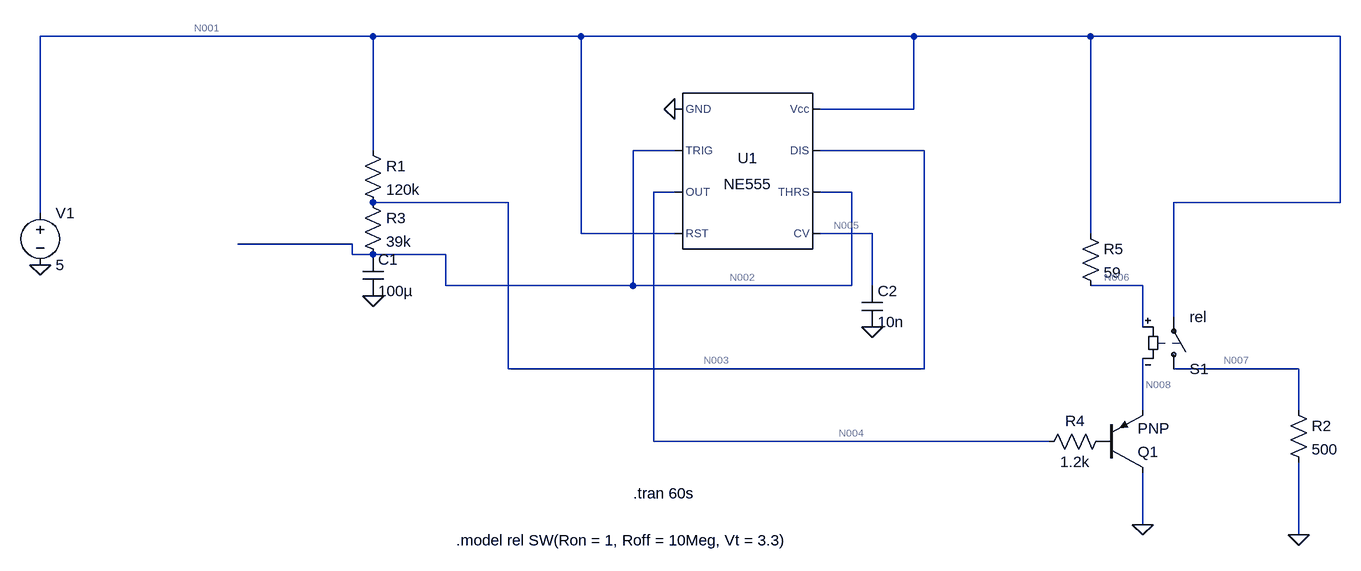
[diagram p0: schematic board_red_inv.asc]
board_red_inv.asc, the LTspice schematic file:
Version 4
SHEET 1 1948 856
WIRE 32 64 -480 64
WIRE 352 64 32 64
WIRE 864 64 352 64
WIRE 1136 64 864 64
WIRE 1520 64 1136 64
WIRE 864 176 864 64
WIRE 864 176 720 176
WIRE 32 240 32 64
WIRE 496 240 432 240
WIRE 880 240 720 240
WIRE 496 304 464 304
WIRE 768 304 720 304
WIRE 240 320 32 320
WIRE 1520 320 1520 64
WIRE 1520 320 1264 320
WIRE -480 336 -480 64
WIRE 352 368 352 64
WIRE 496 368 352 368
WIRE 800 368 720 368
WIRE 1136 368 1136 64
WIRE 0 384 -176 384
WIRE 0 400 0 384
WIRE 32 400 0 400
WIRE 144 400 32 400
WIRE 144 448 144 400
WIRE 432 448 432 240
WIRE 432 448 144 448
WIRE 768 448 768 304
WIRE 768 448 432 448
WIRE 800 448 800 368
WIRE 1216 448 1136 448
WIRE 1264 496 1264 320
WIRE 1216 512 1216 448
WIRE 240 576 240 320
WIRE 880 576 880 240
WIRE 880 576 240 576
WIRE 1456 576 1264 576
WIRE 1216 640 1216 560
WIRE 1456 640 1456 576
WIRE 464 688 464 304
WIRE 1072 688 464 688
WIRE 1216 816 1216 736
WIRE 1456 832 1456 720
FLAG 800 512 0
FLAG -480 416 0
FLAG 496 176 0
FLAG 32 464 0
FLAG 1216 816 0
FLAG 1456 832 0
SYMBOL Misc/NE555 608 272 R0
SYMATTR InstName U1
SYMBOL Res 16 224 R0
SYMATTR InstName R1
SYMATTR Value 120k
SYMBOL Res 16 304 R0
SYMATTR InstName R3
SYMATTR Value 39k
SYMBOL Cap 16 400 R0
SYMATTR InstName C1
SYMATTR Value 100µ
SYMBOL Voltage -480 320 R0
SYMATTR InstName V1
SYMATTR Value 5
SYMBOL Cap 784 448 R0
SYMATTR InstName C2
SYMATTR Value 10n
SYMBOL Res 1168 672 R90
WINDOW 0 0 56 VBottom 2
WINDOW 3 32 56 VTop 2
SYMATTR InstName R4
SYMATTR Value 1.2k
SYMBOL pnp 1152 736 M180
SYMATTR InstName Q1
SYMBOL sw 1264 592 M180
SYMATTR InstName S1
SYMATTR Value rel
SYMBOL Res 1440 624 R0
SYMATTR InstName R2
SYMATTR Value 500
SYMBOL Res 1120 352 R0
SYMATTR InstName R5
SYMATTR Value 59
TEXT 432 768 Left 2 !.tran 60s
TEXT 160 840 Left 2 !.model rel SW(Ron = 1, Roff = 10Meg, Vt = 3.3)

The netlist it stands for:
* board_red_inv.asc
XU1 0 N002 N004 N001 N005 N002 N003 N001 NE555  ; pins GND TRIG OUT RST CV THRS DIS Vcc
R1 N001 N003 120k
R3 N003 N002 39k
C1 N002 0 100µ
V1 N001 0 5
C2 N005 0 10n
R4 P001 N004 1.2k
Q1 0 P001 N008 0 PNP
S1 N007 N001 N006 N008 rel
R2 N007 0 500
R5 N001 N006 59
.model NPN NPN
.model PNP PNP
.lib standard.bjt
.tran 60s
.model rel SW(Ron = 1, Roff = 10Meg, Vt = 3.3)
.lib NE555.sub
.backanno
.end

* Results of the author's LTspice run, read from the files saved beside the schematic
* Operating Point, zero values left out:
*   V(n002) = 4.998 V
*   V(n005) = 3.333 V
*   V(n001) = 5 V
*   V(n003) = 4.998 V
*   V(n004) = 5 V
*   V(p001) = 5 V
*   V(n008) = 5 V
*   V(n007) = 250 µV
*   V(n006) = 5 V
*   Ic(Q1) = -5 pA
*   Ib(Q1) = 5 pA
*   I(R1) = 16.66 nA
*   I(R3) = 9.995 nA
*   I(R4) = -5 pA
*   I(R2) = 500 nA
*   I(S1) = 500 nA
*   I(V1) = -1.612 mA
*   Ix(u1:1) = -1.611 mA
*   Ix(u1:2) = 4.998 nA
*   Ix(u1:3) = -5 pA
*   Ix(u1:4) = 22.67 µA
*   Ix(u1:6) = 4.998 nA
*   Ix(u1:7) = 6.669 nA
*   Ix(u1:8) = 1.588 mA
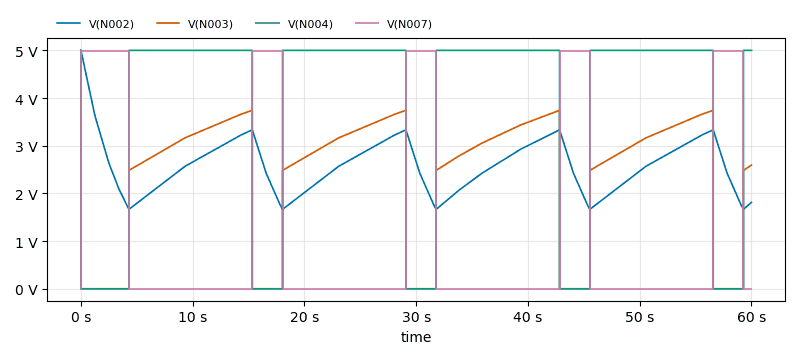
[diagram p1: Transient Analysis of board_red_inv.asc, plotted from the saved traces]
* Transient Analysis, 1 run:
*   V(N002): min 1.666 V, max 4.998 V, average 2.576 V, rms 2.651 V, last 1.813 V
*   V(N003): min 506.2 µV, max 4.998 V, average 2.367 V, rms 2.761 V, last 2.594 V
*   V(N004): min 30 µV, max 5 V, average 3.74 V, rms 4.325 V, last 5 V
*   V(N007): min 250 µV, max 4.99 V, average 1.257 V, rms 2.505 V, last 250 µV